# Altium schematic sheet Sheet1.SchDoc (part 3 of 3)
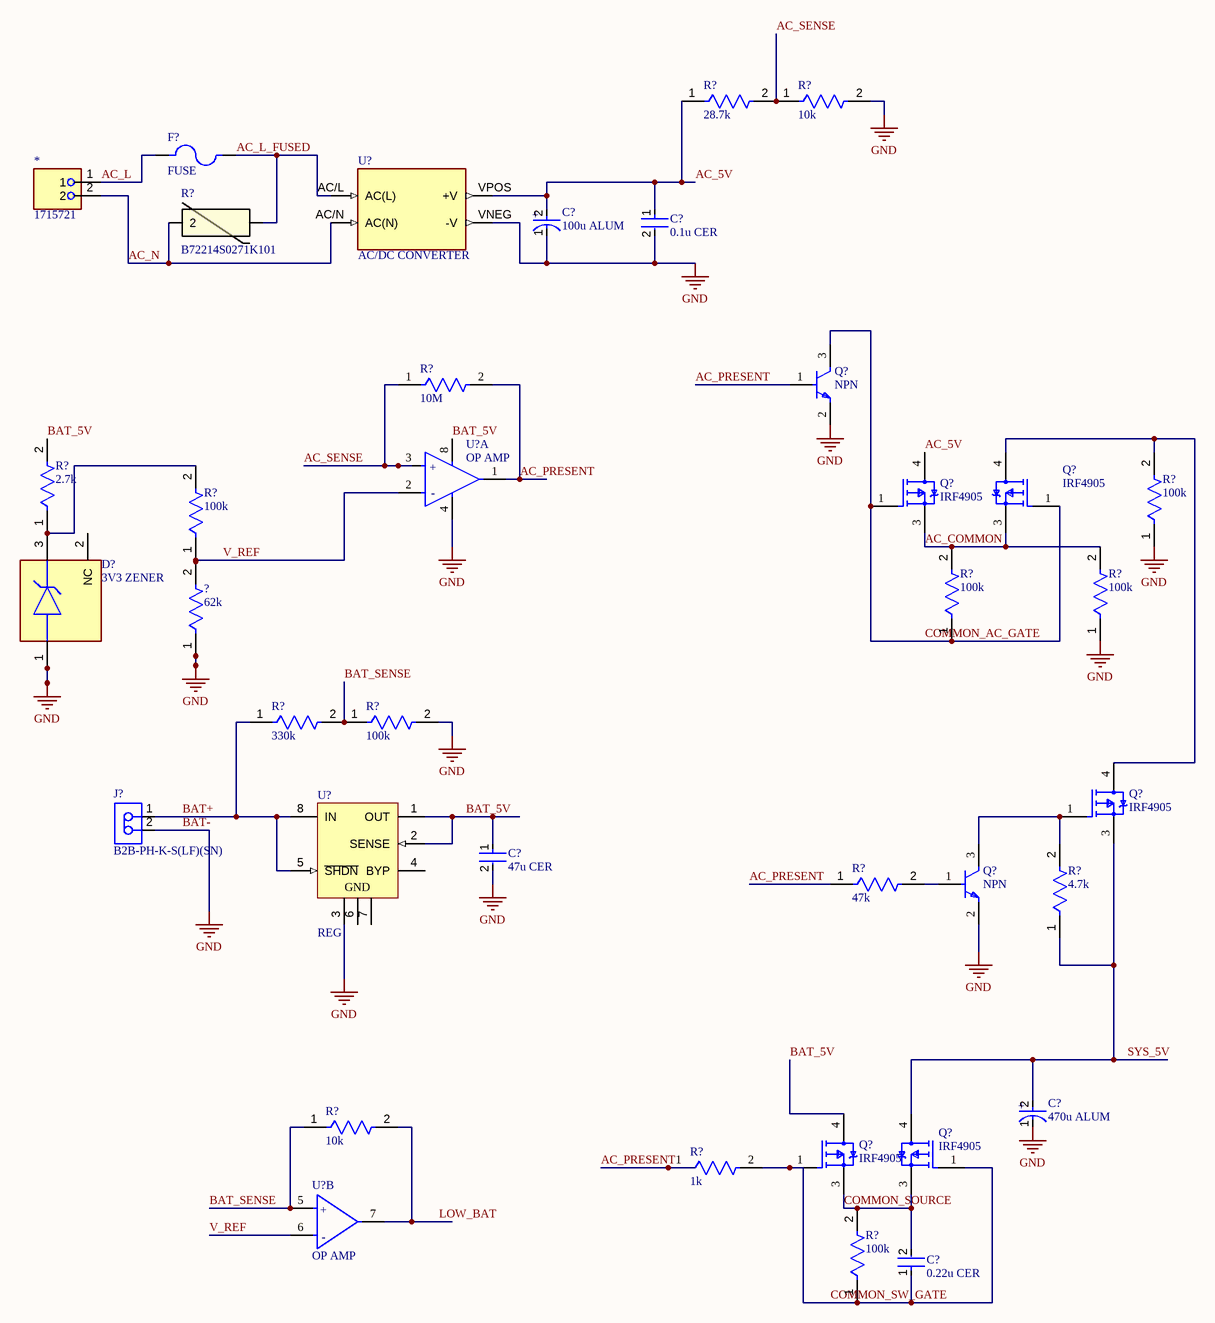
[diagram p2: Sheet1.SchDoc]

## Library data of the parts (continued)
R?#1 = RT0805BRD0728K7L: RES SMD 28.7K OHM 0.1% 1/8W 0805; Manufacturer: Yageo Group; Manufacturer Package Identifier: 0805 (2012 metric); Max Power Dissipation: 125mW; Value: 28.7kΩ; Temperature Coefficient: 25ppm/°C; Voltage Rating: 150V; Supplier: Avnet; Supplier Part Number: RT0805BRD0728K7L; Manufacturer Part Number: RT0805BRD0728K7L; RoHS: Compliant; Category: Chip SMD Resistors; Pricing: 5000=0.0408, 10000=0.0406, 20000=0.04039, 40000=0.04019, 80000=0.03998 (USD); Case/Package: 0805; Case Code (Imperial): 0805; China RoHS: Non-Compliant; Composition: Thin Film; Country of Origin: Mainland China, Taiwan; Depth: 1.25mm; Export Control Classification Number (ECCN) Code: EAR99; Height: 500µm; Harmonized Tariff Schedule (HTS) Code: 8533.21.00.30; Introduction Date: 2008-06-09; Lead Free: Lead Free; Length: 2mm; Lifecycle Status: Production; Max Operating Temperature: 155°C; Military Standard: Not; Min Operating Temperature: -55°C; Mounting Technology: Surface Mount; Number of Terminals: 2; Number of Terminations: 2; Power Rating: 125mW; REACH SVHC: Unaffected; Termination: SMD/SMT; Tolerance: 0.1%; Voltage Rating (DC): 150V; Weight: 5.499807mg; Width: 1.25mm; Working Voltage: 150V; ComponentLink1URL: https://datasheet.octopart.com:443/RT0805BRD0728K7L-Yageo-datasheet-176402239.pdf?src-supplier=IHS; ComponentLink1Description: https://datasheet.octopart.com:443/RT0805BRD0728K7L-Yageo-datasheet-176402239.pdf?src-supplier=IHS; ComponentLink2URL: https://datasheet.octopart.com:443/RT0805BRD0728K7L-Yageo-datasheet-96443642.pdf?src-supplier=Upverter; ComponentLink2Description: https://datasheet.octopart.com:443/RT0805BRD0728K7L-Yageo-datasheet-96443642.pdf?src-supplier=Upverter; ComponentLink3URL: https://datasheet.octopart.com:443/RT0805BRD0728K7L-Yageo-Group-datasheet-141265893.pdf?src-supplier=ODG+(Origin+Data+Global); ComponentLink3Description: https://datasheet.octopart.com:443/RT0805BRD0728K7L-Yageo-Group-datasheet-141265893.pdf?src-supplier=ODG+(Origin+Data+Global); ComponentLink4URL: https://datasheet.octopart.com/RT0805BRD0728K7L-Yageo-datasheet-86813807.pdf; ComponentLink4Description: https://datasheet.octopart.com/RT0805BRD0728K7L-Yageo-datasheet-86813807.pdf; ComponentLink5URL: http://sigma.octopart.com:80/conflict_mineral_statement/Yageo-company-3.pdf?src-supplier=Compliance+Statements; ComponentLink5Description: http://sigma.octopart.com:80/conflict_mineral_statement/Yageo-company-3.pdf?src-supplier=Compliance+Statements; ComponentLink6URL: http://sigma.octopart.com:80/rohs_statement/Yageo-company-2.pdf?src-supplier=Compliance+Statements; ComponentLink6Description: http://sigma.octopart.com:80/rohs_statement/Yageo-company-2.pdf?src-supplier=Compliance+Statements
R?#2 R?#14 = CRCW080510K0FKEA: RES SMD 10K OHM 1% 1/8W 0805; Manufacturer: Vishay; Manufacturer Package Identifier: CRCW0805-e3; Power Rating: 125mW; Value: 10kΩ; Temperature Coefficient: 100ppm/°C; Voltage Rating: 150V; Supplier: Future Electronics; Supplier Part Number: CRCW080510K0FKEA; Manufacturer Part Number: CRCW080510K0FKEA; RoHS: Compliant; Category: Chip SMD Resistors; Stock: 5460000; Pricing: 10000=0.0023, 50000=0.0022, 125000=0.0022, 375000=0.0021, 750000=0.002 (USD); Case/Package: 0805; Case Code (Imperial): 0805; China RoHS: Non-Compliant; Composition: Thick Film; Contact Plating: Tin; Country of Origin: Israel; Depth: 1.25mm; Export Control Classification Number (ECCN) Code: EAR99; Height: 450µm; Harmonized Tariff Schedule (HTS) Code: 8533.21.00.30; Introduction Date: 2005-02-16; Lead Free: Lead Free; Length: 2mm; Lifecycle Status: Production; Max Operating Temperature: 155°C; Military Standard: Not; Min Operating Temperature: -55°C; Mounting Technology: Surface Mount; Pins: 2; Number of Terminals: 2; Packaging: Cut Tape; Radiation Hardening: No; Ratings: AEC-Q200; REACH SVHC: Unaffected; Schedule B: 8533210045, 8533210045|8533210045|8533210045|8533210045|8533210045|8533210045|8533210045|8533210045|8533210045|8533210045|8533210045|8533210045|8533210045|8533210045|8533210045|8533210045|8533210045|8533210045|8533210045|8533210045|8533210045|8533210045|8533210045|85; Termination: SMD/SMT; Tolerance: 1%; Voltage Rating (DC): 150V; Weight: 5.499807mg; Width: 1.25mm; Working Voltage: 150V; ComponentLink1URL: https://datasheet.octopart.com:443/CRCW080510K0FKEA-Vishay-datasheet-175423584.pdf?src-supplier=IHS; ComponentLink1Description: https://datasheet.octopart.com:443/CRCW080510K0FKEA-Vishay-datasheet-175423584.pdf?src-supplier=IHS; ComponentLink2URL: https://datasheet.octopart.com:443/CRCW080510K0FKEA-Vishay-datasheet-5300368.pdf?src-supplier=Future+Electronics; ComponentLink2Description: https://datasheet.octopart.com:443/CRCW080510K0FKEA-Vishay-datasheet-5300368.pdf?src-supplier=Future+Electronics; ComponentLink3URL: https://datasheet.octopart.com:443/CRCW080510K0FKEA-Vishay-datasheet-62316122.pdf?src-supplier=Future+Electronics; ComponentLink3Description: https://datasheet.octopart.com:443/CRCW080510K0FKEA-Vishay-datasheet-62316122.pdf?src-supplier=Future+Electronics; ComponentLink4URL: https://datasheet.octopart.com:443/CRCW080510K0FKEA-Vishay-datasheet-83961561.pdf?src-supplier=Newark; ComponentLink4Description: https://datasheet.octopart.com:443/CRCW080510K0FKEA-Vishay-datasheet-83961561.pdf?src-supplier=Newark; ComponentLink5URL: https://datasheet.octopart.com:443/CRCW080510K0FKEA-Vishay-datasheet-14722531.pdf?src-supplier=Newark; ComponentLink5Description: https://datasheet.octopart.com:443/CRCW080510K0FKEA-Vishay-datasheet-14722531.pdf?src-supplier=Newark; ComponentLink6URL: https://datasheet.octopart.com:443/CRCW080510K0FKEA-Vishay-datasheet-62317937.pdf?src-supplier=Newark; ComponentLink6Description: https://datasheet.octopart.com:443/CRCW080510K0FKEA-Vishay-datasheet-62317937.pdf?src-supplier=Newark; ComponentLink7URL: https://datasheet.octopart.com:443/CRCW080510K0FKEA-Vishay-datasheet-11516975.pdf?src-supplier=Newark; ComponentLink7Description: https://datasheet.octopart.com:443/CRCW080510K0FKEA-Vishay-datasheet-11516975.pdf?src-supplier=Newark; ComponentLink8URL: https://datasheet.octopart.com:443/CRCW080510K0FKEA-Vishay-datasheet-183883877.pdf?src-supplier=Newark; ComponentLink8Description: https://datasheet.octopart.com:443/CRCW080510K0FKEA-Vishay-datasheet-183883877.pdf?src-supplier=Newark; ComponentLink9URL: https://datasheet.octopart.com:443/CRCW080510K0FKEA-Vishay-datasheet-41302739.pdf?src-supplier=Newark; ComponentLink9Description: https://datasheet.octopart.com:443/CRCW080510K0FKEA-Vishay-datasheet-41302739.pdf?src-supplier=Newark; ComponentLink10URL: https://datasheet.octopart.com:443/CRCW080510K0FKEA-Vishay-datasheet-27121962.pdf?src-supplier=Newark; ComponentLink10Description: https://datasheet.octopart.com:443/CRCW080510K0FKEA-Vishay-datasheet-27121962.pdf?src-supplier=Newark; ComponentLink11URL: https://datasheet.octopart.com:443/CRCW080510K0FKEA-Vishay-datasheet-16179825.pdf?src-supplier=element14+APAC; ComponentLink11Description: https://datasheet.octopart.com:443/CRCW080510K0FKEA-Vishay-datasheet-16179825.pdf?src-supplier=element14+APAC; ComponentLink12URL: https://datasheet.octopart.com:443/CRCW080510K0FKEA-Vishay-datasheet-66077789.pdf?src-supplier=element14+APAC; ComponentLink12Description: https://datasheet.octopart.com:443/CRCW080510K0FKEA-Vishay-datasheet-66077789.pdf?src-supplier=element14+APAC; ComponentLink13URL: https://datasheet.octopart.com:443/CRCW080510K0FKEA-Vishay-datasheet-5306405.pdf?src-supplier=RS+(Formerly+Allied+Electronics); ComponentLink13Description: https://datasheet.octopart.com:443/CRCW080510K0FKEA-Vishay-datasheet-5306405.pdf?src-supplier=RS+(Formerly+Allied+Electronics); ComponentLink14URL: https://datasheet.octopart.com:443/CRCW080510K0FKEA-Vishay-Dale-datasheet-47688880.pdf?src-supplier=RS+(Formerly+Allied+Electronics); ComponentLink14Description: https://datasheet.octopart.com:443/CRCW080510K0FKEA-Vishay-Dale-datasheet-47688880.pdf?src-supplier=RS+(Formerly+Allied+Electronics); ComponentLink15URL: https://datasheet.octopart.com:443/CRCW080510K0FKEA-Vishay-datasheet-12001583.pdf?src-supplier=RS+(Formerly+Allied+Electronics); ComponentLink15Description: https://datasheet.octopart.com:443/CRCW080510K0FKEA-Vishay-datasheet-12001583.pdf?src-supplier=RS+(Formerly+Allied+Electronics); ComponentLink16URL: https://datasheet.octopart.com:443/CRCW080510K0FKEA-Vishay-datasheet-17834126.pdf?src-supplier=TME; ComponentLink16Description: https://datasheet.octopart.com:443/CRCW080510K0FKEA-Vishay-datasheet-17834126.pdf?src-supplier=TME; ComponentLink17URL: https://datasheet.octopart.com/D-CRCW-e3-Standard-Thick-Film-Chip-Resistors-Vishay-datasheet-family-64.pdf; ComponentLink17Description: https://datasheet.octopart.com/D-CRCW-e3-Standard-Thick-Film-Chip-Resistors-Vishay-datasheet-family-64.pdf; ComponentLink18URL: https://datasheet.octopart.com:443/CRCW080510K0FKEA-Vishay-datasheet-13242068.pdf?src-supplier=Farnell; ComponentLink18Description: https://datasheet.octopart.com:443/CRCW080510K0FKEA-Vishay-datasheet-13242068.pdf?src-supplier=Farnell; ComponentLink19URL: https://datasheet.octopart.com:443/CRCW080510K0FKEA-Vishay-datasheet-13195083.pdf?src-supplier=Farnell; ComponentLink19Description: https://datasheet.octopart.com:443/CRCW080510K0FKEA-Vishay-datasheet-13195083.pdf?src-supplier=Farnell; ComponentLink20URL: https://datasheet.octopart.com:443/CRCW080510K0FKEA-Vishay-datasheet-13034211.pdf?src-supplier=Farnell; ComponentLink20Description: https://datasheet.octopart.com:443/CRCW080510K0FKEA-Vishay-datasheet-13034211.pdf?src-supplier=Farnell; ComponentLink21URL: https://datasheet.octopart.com:443/CRCW080510K0FKEA-Vishay-datasheet-12600034.pdf?src-supplier=Farnell; ComponentLink21Description: https://datasheet.octopart.com:443/CRCW080510K0FKEA-Vishay-datasheet-12600034.pdf?src-supplier=Farnell; ComponentLink22URL: https://datasheet.octopart.com:443/CRCW080510K0FKEA-Vishay-datasheet-12532161.pdf?src-supplier=Farnell; ComponentLink22Description: https://datasheet.octopart.com:443/CRCW080510K0FKEA-Vishay-datasheet-12532161.pdf?src-supplier=Farnell; ComponentLink23URL: https://datasheet.octopart.com:443/CRCW080510K0FKEA-Vishay-datasheet-12517896.pdf?src-supplier=Farnell; ComponentLink23Description: https://datasheet.octopart.com:443/CRCW080510K0FKEA-Vishay-datasheet-12517896.pdf?src-supplier=Farnell; ComponentLink24URL: https://datasheet.octopart.com:443/CRCW080510K0FKEA-Vishay-datasheet-12509762.pdf?src-supplier=Farnell; ComponentLink24Description: https://datasheet.octopart.com:443/CRCW080510K0FKEA-Vishay-datasheet-12509762.pdf?src-supplier=Farnell; ComponentLink25URL: https://datasheet.octopart.com:443/CRCW080510K0FKEA-Vishay-datasheet-10322335.pdf?src-supplier=Farnell; ComponentLink25Description: https://datasheet.octopart.com:443/CRCW080510K0FKEA-Vishay-datasheet-10322335.pdf?src-supplier=Farnell; ComponentLink26URL: https://datasheet.octopart.com:443/CRCW080510K0FKEA-Vishay-datasheet-8788789.pdf?src-supplier=Farnell; ComponentLink26Description: https://datasheet.octopart.com:443/CRCW080510K0FKEA-Vishay-datasheet-8788789.pdf?src-supplier=Farnell; ComponentLink27URL: https://datasheet.octopart.com:443/CRCW080510K0FKEA-Vishay-datasheet-8361388.pdf?src-supplier=Farnell; ComponentLink27Description: https://datasheet.octopart.com:443/CRCW080510K0FKEA-Vishay-datasheet-8361388.pdf?src-supplier=Farnell; ComponentLink28URL: https://datasheet.octopart.com:443/CRCW080510K0FKEA-Vishay-datasheet-546287.pdf?src-supplier=Farnell; ComponentLink28Description: https://datasheet.octopart.com:443/CRCW080510K0FKEA-Vishay-datasheet-546287.pdf?src-supplier=Farnell; ComponentLink29URL: https://datasheet.octopart.com:443/CRCW080510K0FKEA-Vishay-datasheet-11540273.pdf?src-supplier=Arrow+Electronics; ComponentLink29Description: https://datasheet.octopart.com:443/CRCW080510K0FKEA-Vishay-datasheet-11540273.pdf?src-supplier=Arrow+Electronics; ComponentLink30URL: https://datasheet.octopart.com:443/CRCW080510K0FKEA-Vishay-datasheet-8445837.pdf?src-supplier=element14; ComponentLink30Description: https://datasheet.octopart.com:443/CRCW080510K0FKEA-Vishay-datasheet-8445837.pdf?src-supplier=element14; ComponentLink31URL: https://datasheet.octopart.com:443/CRCW080510K0FKEA-Vishay-datasheet-5377306.pdf?src-supplier=Garrett; ComponentLink31Description: https://datasheet.octopart.com:443/CRCW080510K0FKEA-Vishay-datasheet-5377306.pdf?src-supplier=Garrett; ComponentLink32URL: https://datasheet.octopart.com:443/CRCW080510K0FKEA-Vishay-datasheet-148188.pdf?src-supplier=Garrett; ComponentLink32Description: https://datasheet.octopart.com:443/CRCW080510K0FKEA-Vishay-datasheet-148188.pdf?src-supplier=Garrett; ComponentLink33URL: https://datasheet.octopart.com:443/CRCW080510K0FKEA-Vishay-datasheet-34203.pdf?src-supplier=Garrett; ComponentLink33Description: https://datasheet.octopart.com:443/CRCW080510K0FKEA-Vishay-datasheet-34203.pdf?src-supplier=Garrett; ComponentLink34URL: http://sigma.octopart.com:80/rohs_certificate/D-CRCW-e3-Standard-Thick-Film-Chip-Resistors-Vishay-family-102.pdf?src-supplier=Compliance+Statements; ComponentLink34Description: http://sigma.octopart.com:80/rohs_certificate/D-CRCW-e3-Standard-Thick-Film-Chip-Resistors-Vishay-family-102.pdf?src-supplier=Compliance+Statements
R?#3 = B72214S0271K101: VARISTOR 430V 4.5KA DISC 14MM; Manufacturer_Name: TDK; Copyright: Copyright (C) 2026 Ultra Librarian. All rights reserved.; Manufacturer_Part_Number: B72214S0271K101
R?#4 = CRCW080510M0FKEA: RES SMD 10M OHM 1% 1/8W 0805; Manufacturer: Vishay; Manufacturer Package Identifier: CRCW0805-e3; Max Power Dissipation: 125mW; Value: 10MΩ; Temperature Coefficient: 100ppm/°C; Voltage Rating: 150V; Supplier: Future Electronics; Supplier Part Number: CRCW080510M0FKEA; Manufacturer Part Number: CRCW080510M0FKEA; RoHS: Compliant; Category: Chip SMD Resistors; Stock: 85000; Pricing: 5000=0.0094, 20000=0.0091, 50000=0.0089, 125000=0.0087, 200000=0.0084 (USD); Case/Package: 0805; Case Code (Imperial): 0805; China RoHS: Non-Compliant; Composition: Thick Film; Contact Plating: Tin; Country of Origin: Israel; Depth: 1.25mm; Export Control Classification Number (ECCN) Code: EAR99; Features: Automotive AEC-Q200; Height: 450µm; Harmonized Tariff Schedule (HTS) Code: 8533.21.00.30; Introduction Date: 2005-02-16; Lead Free: Lead Free; Length: 2mm; Lifecycle Status: Production; Max Operating Temperature: 155°C; Military Standard: Not; Min Operating Temperature: -55°C; Mounting Technology: Surface Mount; Pins: 2; Number of Terminals: 2; Number of Terminations: 2; Packaging: Cut Tape; Power Rating: 125mW; Radiation Hardening: No; Ratings: AEC-Q200; REACH SVHC: Unaffected; Schedule B: 8533210045, 8533210045|8533210045|8533210045|8533210045|8533210045|8533210045|8533210045|8533210045|8533210045|8533210045|8533210045|8533210045|8533210045|8533210045|8533210045|8533210045|8533210045|8533210045|8533210045|8533210045|8533210045|8533210045|8533210045|85; Termination: SMD/SMT; Tolerance: 1%; Voltage Rating (DC): 150V; Weight: 5.499807mg; Width: 1.25mm; Working Voltage: 150V; ComponentLink1URL: https://datasheet.octopart.com:443/CRCW080510M0FKEA-Vishay-datasheet-175423584.pdf?src-supplier=IHS; ComponentLink1Description: https://datasheet.octopart.com:443/CRCW080510M0FKEA-Vishay-datasheet-175423584.pdf?src-supplier=IHS; ComponentLink2URL: https://datasheet.octopart.com:443/CRCW080510M0FKEA-Vishay-datasheet-83961561.pdf?src-supplier=element14+APAC; ComponentLink2Description: https://datasheet.octopart.com:443/CRCW080510M0FKEA-Vishay-datasheet-83961561.pdf?src-supplier=element14+APAC; ComponentLink3URL: https://datasheet.octopart.com:443/CRCW080510M0FKEA-Vishay-datasheet-66077789.pdf?src-supplier=element14+APAC; ComponentLink3Description: https://datasheet.octopart.com:443/CRCW080510M0FKEA-Vishay-datasheet-66077789.pdf?src-supplier=element14+APAC; ComponentLink4URL: https://datasheet.octopart.com:443/CRCW080510M0FKEA-Vishay-datasheet-62317939.pdf?src-supplier=element14+APAC; ComponentLink4Description: https://datasheet.octopart.com:443/CRCW080510M0FKEA-Vishay-datasheet-62317939.pdf?src-supplier=element14+APAC; ComponentLink5URL: https://datasheet.octopart.com:443/CRCW080510M0FKEA-Vishay-datasheet-14722531.pdf?src-supplier=element14+APAC; ComponentLink5Description: https://datasheet.octopart.com:443/CRCW080510M0FKEA-Vishay-datasheet-14722531.pdf?src-supplier=element14+APAC; ComponentLink6URL: https://datasheet.octopart.com:443/CRCW080510M0FKEA-Vishay-datasheet-16179825.pdf?src-supplier=element14+APAC; ComponentLink6Description: https://datasheet.octopart.com:443/CRCW080510M0FKEA-Vishay-datasheet-16179825.pdf?src-supplier=element14+APAC; ComponentLink7URL: https://datasheet.octopart.com:443/CRCW080510M0FKEA.-Vishay-datasheet-78776211.pdf?src-supplier=Newark; ComponentLink7Description: https://datasheet.octopart.com:443/CRCW080510M0FKEA.-Vishay-datasheet-78776211.pdf?src-supplier=Newark; ComponentLink8URL: https://datasheet.octopart.com:443/CRCW080510M0FKEA-Vishay-datasheet-11516975.pdf?src-supplier=Newark; ComponentLink8Description: https://datasheet.octopart.com:443/CRCW080510M0FKEA-Vishay-datasheet-11516975.pdf?src-supplier=Newark; ComponentLink9URL: https://datasheet.octopart.com:443/CRCW080510M0FKEA-Vishay-datasheet-41302739.pdf?src-supplier=Newark; ComponentLink9Description: https://datasheet.octopart.com:443/CRCW080510M0FKEA-Vishay-datasheet-41302739.pdf?src-supplier=Newark; ComponentLink10URL: https://datasheet.octopart.com:443/CRCW080510M0FKEA-Vishay-datasheet-8.pdf?src-supplier=Newark; ComponentLink10Description: https://datasheet.octopart.com:443/CRCW080510M0FKEA-Vishay-datasheet-8.pdf?src-supplier=Newark; ComponentLink11URL: https://datasheet.octopart.com:443/CRCW080510M0FKEA-Vishay-datasheet-8725101.pdf?src-supplier=element14; ComponentLink11Description: https://datasheet.octopart.com:443/CRCW080510M0FKEA-Vishay-datasheet-8725101.pdf?src-supplier=element14; ComponentLink12URL: https://datasheet.octopart.com:443/CRCW080510M0FKEA-Vishay-datasheet-5306405.pdf?src-supplier=Future+Electronics; ComponentLink12Description: https://datasheet.octopart.com:443/CRCW080510M0FKEA-Vishay-datasheet-5306405.pdf?src-supplier=Future+Electronics; ComponentLink13URL: https://datasheet.octopart.com:443/CRCW080510M0FKEA-Vishay-datasheet-62316122.pdf?src-supplier=Future+Electronics; ComponentLink13Description: https://datasheet.octopart.com:443/CRCW080510M0FKEA-Vishay-datasheet-62316122.pdf?src-supplier=Future+Electronics; ComponentLink14URL: https://datasheet.octopart.com:443/CRCW080510M0FKEA-Vishay-datasheet-13242068.pdf?src-supplier=Future+Electronics; ComponentLink14Description: https://datasheet.octopart.com:443/CRCW080510M0FKEA-Vishay-datasheet-13242068.pdf?src-supplier=Future+Electronics; ComponentLink15URL: https://datasheet.octopart.com:443/CRCW080510M0FKEA-Vishay-datasheet-13195083.pdf?src-supplier=Future+Electronics; ComponentLink15Description: https://datasheet.octopart.com:443/CRCW080510M0FKEA-Vishay-datasheet-13195083.pdf?src-supplier=Future+Electronics; ComponentLink16URL: https://datasheet.octopart.com:443/CRCW080510M0FKEA-Vishay-datasheet-13034211.pdf?src-supplier=Future+Electronics; ComponentLink16Description: https://datasheet.octopart.com:443/CRCW080510M0FKEA-Vishay-datasheet-13034211.pdf?src-supplier=Future+Electronics; ComponentLink17URL: https://datasheet.octopart.com:443/CRCW080510M0FKEA-Vishay-datasheet-12600034.pdf?src-supplier=Future+Electronics; ComponentLink17Description: https://datasheet.octopart.com:443/CRCW080510M0FKEA-Vishay-datasheet-12600034.pdf?src-supplier=Future+Electronics; ComponentLink18URL: https://datasheet.octopart.com:443/CRCW080510M0FKEA-Vishay-datasheet-12532161.pdf?src-supplier=Future+Electronics; ComponentLink18Description: https://datasheet.octopart.com:443/CRCW080510M0FKEA-Vishay-datasheet-12532161.pdf?src-supplier=Future+Electronics; ComponentLink19URL: https://datasheet.octopart.com:443/CRCW080510M0FKEA-Vishay-datasheet-12517896.pdf?src-supplier=Future+Electronics; ComponentLink19Description: https://datasheet.octopart.com:443/CRCW080510M0FKEA-Vishay-datasheet-12517896.pdf?src-supplier=Future+Electronics; ComponentLink20URL: https://datasheet.octopart.com:443/CRCW080510M0FKEA-Vishay-datasheet-12509762.pdf?src-supplier=Future+Electronics; ComponentLink20Description: https://datasheet.octopart.com:443/CRCW080510M0FKEA-Vishay-datasheet-12509762.pdf?src-supplier=Future+Electronics; ComponentLink21URL: https://datasheet.octopart.com:443/CRCW080510M0FKEA-Vishay-datasheet-10322335.pdf?src-supplier=Future+Electronics; ComponentLink21Description: https://datasheet.octopart.com:443/CRCW080510M0FKEA-Vishay-datasheet-10322335.pdf?src-supplier=Future+Electronics; ComponentLink22URL: https://datasheet.octopart.com:443/CRCW080510M0FKEA-Vishay-datasheet-8788789.pdf?src-supplier=Future+Electronics; ComponentLink22Description: https://datasheet.octopart.com:443/CRCW080510M0FKEA-Vishay-datasheet-8788789.pdf?src-supplier=Future+Electronics; ComponentLink23URL: https://datasheet.octopart.com:443/CRCW080510M0FKEA-Vishay-datasheet-8361388.pdf?src-supplier=Future+Electronics; ComponentLink23Description: https://datasheet.octopart.com:443/CRCW080510M0FKEA-Vishay-datasheet-8361388.pdf?src-supplier=Future+Electronics; ComponentLink24URL: https://datasheet.octopart.com:443/CRCW080510M0FKEA-Vishay-datasheet-546287.pdf?src-supplier=Future+Electronics; ComponentLink24Description: https://datasheet.octopart.com:443/CRCW080510M0FKEA-Vishay-datasheet-546287.pdf?src-supplier=Future+Electronics; ComponentLink25URL: https://datasheet.octopart.com:443/CRCW080510M0FKEA-Vishay-datasheet-137114595.pdf?src-supplier=X-ON; ComponentLink25Description: https://datasheet.octopart.com:443/CRCW080510M0FKEA-Vishay-datasheet-137114595.pdf?src-supplier=X-ON; ComponentLink26URL: https://datasheet.octopart.com:443/CRCW080510M0FKEA-Vishay-Dale-datasheet-47688880.pdf?src-supplier=RS+(Formerly+Allied+Electronics); ComponentLink26Description: https://datasheet.octopart.com:443/CRCW080510M0FKEA-Vishay-Dale-datasheet-47688880.pdf?src-supplier=RS+(Formerly+Allied+Electronics); ComponentLink27URL: https://datasheet.octopart.com:443/CRCW080510M0FKEA-Vishay-datasheet-12001583.pdf?src-supplier=RS+(Formerly+Allied+Electronics); ComponentLink27Description: https://datasheet.octopart.com:443/CRCW080510M0FKEA-Vishay-datasheet-12001583.pdf?src-supplier=RS+(Formerly+Allied+Electronics); ComponentLink28URL: https://datasheet.octopart.com/D-CRCW-e3-Standard-Thick-Film-Chip-Resistors-Vishay-datasheet-family-64.pdf; ComponentLink28Description: https://datasheet.octopart.com/D-CRCW-e3-Standard-Thick-Film-Chip-Resistors-Vishay-datasheet-family-64.pdf; ComponentLink29URL: https://datasheet.octopart.com:443/CRCW080510M0FKEA-Vishay-datasheet-5377306.pdf?src-supplier=Garrett; ComponentLink29Description: https://datasheet.octopart.com:443/CRCW080510M0FKEA-Vishay-datasheet-5377306.pdf?src-supplier=Garrett; ComponentLink30URL: http://sigma.octopart.com:80/rohs_certificate/D-CRCW-e3-Standard-Thick-Film-Chip-Resistors-Vishay-family-102.pdf?src-supplier=Compliance+Statements; ComponentLink30Description: http://sigma.octopart.com:80/rohs_certificate/D-CRCW-e3-Standard-Thick-Film-Chip-Resistors-Vishay-family-102.pdf?src-supplier=Compliance+Statements
R?#5 = CRCW08052K70FKEA: RES SMD 2.7K OHM 1% 1/8W 0805; Voltage Rating (DC): 150V; Power Rating: 125mW; Resistance: 2.7kR; Temperature Coefficient: 100ppm/°C; Composition: Thick Film; Mount: Surface Mount; Case Code (Imperial): 0805; Features: Automotive AEC-Q200; Depth: 1.25mm; Height: 0.45mm; Weight: 0.000194oz; Min Operating Temperature: -55°C; Case Code (Metric): 2012; Number of Pins: 2; Packaging: Tape and Reel; Width: 1.25mm; Military Standard: Not; Max Power Dissipation: 125mW; Tolerance: 1%; Case/Package: 0805; Lead Free: Lead Free; Max Operating Temperature: 155°C; Number of Terminations: 2; Voltage Rating: 150V; Contact Plating: Tin; Length: 2mm; Termination: SMD/SMT; Package Quantity: 10; Radiation Hardening: No
R?#6-R?#9 R?#11 R?#16 = CRCW0805100KFKEA: RES SMD 100K OHM 1% 1/8W 0805; Resistance: 100kR; Power Rating: 125mW; Voltage Rating: 150V; Temperature Coefficient: 100ppm/°C; Case/Package: 0805; Max Operating Temperature: 155°C; Case Code (Imperial): 0805; Lead Free: Lead Free; Weight: 0.000194oz; Number of Pins: 2; Package Quantity: 5000; Height: 0.45mm; Composition: Thick Film; Military Standard: Not; Tolerance: 1%; Case Code (Metric): 2012; Termination: SMD/SMT; Mount: Surface Mount; Radiation Hardening: No; Width: 1.25mm; Length: 2mm; Depth: 1.25mm; Packaging: Tape and Reel; Min Operating Temperature: -55°C; Contact Plating: Tin; Voltage Rating (DC): 150V
R?#10 = RC0805FR-07330KL: RES SMD 330K OHM 1% 1/8W 0805; Manufacturer: Yageo Group; Max Power Dissipation: 125mW; Value: 330kΩ; Temperature Coefficient: 100ppm/°C; Voltage Rating: 150V; Supplier: Future Electronics; Supplier Part Number: RC0805FR-07330KL; Manufacturer Part Number: RC0805FR-07330KL; RoHS: Compliant; Category: Chip SMD Resistors; Stock: 330000; Pricing: 5000=0.0068, 20000=0.0065, 75000=0.0063, 150000=0.0062, 375000=0.006 (USD); Case/Package: 0805; Case Code (Imperial): 0805; China RoHS: Non-Compliant; Composition: Thick Film; Contact Plating: Tin; Country of Origin: Mainland China, Taiwan; Depth: 1.25mm; Export Control Classification Number (ECCN) Code: EAR99; Features: Moisture Resistant; Height: 500µm; Harmonized Tariff Schedule (HTS) Code: 8533.21.00.30; Introduction Date: 2004-09-22; Lead Free: Lead Free; Length: 2mm; Lifecycle Status: Production; Max Operating Temperature: 155°C; Military Standard: Not; Min Operating Temperature: -55°C; Mounting Technology: Surface Mount; Pins: 2; Number of Terminals: 2; Number of Terminations: 2; Packaging: Tape & Reel; Power Rating: 125mW; Radiation Hardening: No; REACH SVHC: Unaffected; Schedule B: 8533210045, 8533210045|8533210045|8533210045|8533210045|8533210045; Termination: SMD/SMT; Tolerance: 1%; Voltage Rating (AC): 150V; Voltage Rating (DC): 150V; Width: 1.25mm; Working Voltage: 150V; ComponentLink1URL: https://datasheet.octopart.com:443/RC0805FR-07330KL-Yageo-datasheet-175887523.pdf?src-supplier=IHS; ComponentLink1Description: https://datasheet.octopart.com:443/RC0805FR-07330KL-Yageo-datasheet-175887523.pdf?src-supplier=IHS; ComponentLink2URL: https://datasheet.octopart.com:443/RC0805FR-07330KL-Yageo-datasheet-103092701.pdf?src-supplier=Upverter; ComponentLink2Description: https://datasheet.octopart.com:443/RC0805FR-07330KL-Yageo-datasheet-103092701.pdf?src-supplier=Upverter; ComponentLink3URL: https://datasheet.octopart.com:443/RC0805FR-07330KL-Yageo-datasheet-8330313.pdf?src-supplier=element14+APAC; ComponentLink3Description: https://datasheet.octopart.com:443/RC0805FR-07330KL-Yageo-datasheet-8330313.pdf?src-supplier=element14+APAC; ComponentLink4URL: https://datasheet.octopart.com:443/RC0805FR-07330KL-Yageo-Group-datasheet-190305687.pdf?src-supplier=Future+Electronics; ComponentLink4Description: https://datasheet.octopart.com:443/RC0805FR-07330KL-Yageo-Group-datasheet-190305687.pdf?src-supplier=Future+Electronics; ComponentLink5URL: https://datasheet.octopart.com:443/RC0805FR-07330KL-Yageo-datasheet-164759695.pdf?src-supplier=Future+Electronics; ComponentLink5Description: https://datasheet.octopart.com:443/RC0805FR-07330KL-Yageo-datasheet-164759695.pdf?src-supplier=Future+Electronics; ComponentLink6URL: https://datasheet.octopart.com:443/RC0805FR-07330KL-Yageo-datasheet-127823281.pdf?src-supplier=Future+Electronics; ComponentLink6Description: https://datasheet.octopart.com:443/RC0805FR-07330KL-Yageo-datasheet-127823281.pdf?src-supplier=Future+Electronics; ComponentLink7URL: https://datasheet.octopart.com:443/RC0805FR-07330KL-Yageo-datasheet-137700087.pdf?src-supplier=Future+Electronics; ComponentLink7Description: https://datasheet.octopart.com:443/RC0805FR-07330KL-Yageo-datasheet-137700087.pdf?src-supplier=Future+Electronics; ComponentLink8URL: https://datasheet.octopart.com:443/RC0805FR-07330KL-Yageo-datasheet-12592811.pdf?src-supplier=Future+Electronics; ComponentLink8Description: https://datasheet.octopart.com:443/RC0805FR-07330KL-Yageo-datasheet-12592811.pdf?src-supplier=Future+Electronics; ComponentLink9URL: https://datasheet.octopart.com:443/RC0805FR-07330KL-Yageo-datasheet-8324252.pdf?src-supplier=Future+Electronics; ComponentLink9Description: https://datasheet.octopart.com:443/RC0805FR-07330KL-Yageo-datasheet-8324252.pdf?src-supplier=Future+Electronics; ComponentLink10URL: https://datasheet.octopart.com:443/RC0805FR-07330KL-Yageo-datasheet-62067350.pdf?src-supplier=Farnell; ComponentLink10Description: https://datasheet.octopart.com:443/RC0805FR-07330KL-Yageo-datasheet-62067350.pdf?src-supplier=Farnell; ComponentLink11URL: https://datasheet.octopart.com:443/RC0805FR-07330KL-Yageo-datasheet-13691069.pdf?src-supplier=Farnell; ComponentLink11Description: https://datasheet.octopart.com:443/RC0805FR-07330KL-Yageo-datasheet-13691069.pdf?src-supplier=Farnell; ComponentLink12URL: https://datasheet.octopart.com:443/RC0805FR-07330KL-Yageo-Group-datasheet-189192902.pdf?src-supplier=LCSC; ComponentLink12Description: https://datasheet.octopart.com:443/RC0805FR-07330KL-Yageo-Group-datasheet-189192902.pdf?src-supplier=LCSC; ComponentLink13URL: https://datasheet.octopart.com/RC0805FR-07330KL-Yageo-datasheet-73766026.pdf; ComponentLink13Description: https://datasheet.octopart.com/RC0805FR-07330KL-Yageo-datasheet-73766026.pdf; ComponentLink14URL: https://datasheet.octopart.com:443/RC0805FR-07330KL-Yageo-datasheet-118657.pdf?src-supplier=DigiKey; ComponentLink14Description: https://datasheet.octopart.com:443/RC0805FR-07330KL-Yageo-datasheet-118657.pdf?src-supplier=DigiKey; ComponentLink15URL: http://sigma.octopart.com:80/conflict_mineral_statement/Yageo-company-3.pdf?src-supplier=Compliance+Statements; ComponentLink15Description: http://sigma.octopart.com:80/conflict_mineral_statement/Yageo-company-3.pdf?src-supplier=Compliance+Statements; ComponentLink16URL: http://sigma.octopart.com:80/rohs_statement/Yageo-company-2.pdf?src-supplier=Compliance+Statements; ComponentLink16Description: http://sigma.octopart.com:80/rohs_statement/Yageo-company-2.pdf?src-supplier=Compliance+Statements
R?#12 = RC0805FR-0747KL: RES SMD 47K OHM 1% 1/8W 0805; Manufacturer: Yageo; Voltage Rating: 150 V; Height: 0.5 mm; ComponentLink2URL: http://www.yageo.com/documents/recent/PYu-RC_Group_51_RoHS_L_04.pdf; ComponentLink2Description: Datasheet; Package Quantity: 200; Max Operating Temperature: 155 degC; Min Operating Temperature: -55 degC; Packaging: Tape and Reel; Pins: 2; PackageReference: 0805; Mounting Technology: Surface Mount; ComponentLink1Description: Manufacturer URL; ComponentLink1URL: http://www.yageo.com/; PackageDescription: 2-Pin Surface Mounted Device, Body 2 x 1.25 mm; Length: 2 mm; REACH SVHC: No SVHC; Mount: Surface Mount; RoHSCompliant: true; DatasheetVersion: Rev. 4, 02/2016
R?#13 = CRCW08054K70FKEA: RES SMD 4.7K OHM 1% 1/8W 0805; Max Power Dissipation: 125mW; Resistance: 4.7kR; Voltage Rating: 150V; Temperature Coefficient: 100ppm/°C; Termination: SMD/SMT; Weight: 0.000194oz; Case/Package: 0805; Number of Terminations: 2; Min Operating Temperature: -55°C; Case Code (Metric): 2012; Package Quantity: 10; Depth: 1.25mm; Military Standard: Not; Composition: Thick Film; Radiation Hardening: No; Contact Plating: Tin; Height: 0.45mm; Power Rating: 125mW; Features: Automotive AEC-Q200; Tolerance: 1%; Packaging: Tape and Reel; Max Operating Temperature: 155°C; Length: 2mm; Case Code (Imperial): 0805; Voltage Rating (DC): 150V; Width: 1.25mm; Lead Free: Lead Free
R?#15 = CRCW08051K00FKEA: RES SMD 1K OHM 1% 1/8W 0805; Manufacturer: Vishay Dale; Part Number: CRCW08051K00FKEA
U?#1 = IRM-05-5: AC/DC CONVERTER 5V 5W; Manufacturer: Mean Well; Approvals: CB, CE, IEC, TUV, UL; Current - Output 1: 1A; Efficiency: 71%; Max Supply Voltage: 305V; Max Output Voltage: 5.125V; Min Input Voltage: 85V; Min Output Voltage: 4.875V; Nominal Supply Voltage: 115V; Number of Circuits: 1; Supplier: Arrow Electronics; Supplier Part Number: IRM-05-5; Manufacturer Part Number: IRM-05-5; RoHS: Compliant; Category: Power Supply Modules; Stock: 18160; Pricing: 1=7.467, 20=7.35, 50=7.162 (USD); Composition: Hybrid; Export Control Classification Number (ECCN) Code: EAR99; Height: 21.5mm; Height - Seated (Max): 21.5mm; Introduction Date: 2013-07-05; Lead Free: Lead Free; Length: 45.7mm; Lifecycle Status: Production; Max Operating Temperature: 70°C; Max Output current: 1A; Max Output Power: 5W; Max Power Dissipation: 5W; Min Operating Temperature: -30°C; Min Supply Voltage: 85V; Mounting Technology: PCB, Through Hole; Nominal Output Voltage: 5V; Number of Outputs: 1; Pins: 4; Number of Terminals: 4; Output Current: 1A; Output Power: 5W; Output Voltage: 5V; REACH SVHC: Unaffected; Voltage - Output 1: 5V; Weight: 39.999986g; Width: 25.4mm; ComponentLink1URL: https://datasheet.octopart.com:443/IRM-05-5-Mean-Well-datasheet-180626755.pdf?src-supplier=IHS; ComponentLink1Description: https://datasheet.octopart.com:443/IRM-05-5-Mean-Well-datasheet-180626755.pdf?src-supplier=IHS; ComponentLink2URL: https://datasheet.octopart.com:443/IRM-05-5-Mean-Well-datasheet-101610177.pdf?src-supplier=Farnell; ComponentLink2Description: https://datasheet.octopart.com:443/IRM-05-5-Mean-Well-datasheet-101610177.pdf?src-supplier=Farnell; ComponentLink3URL: https://datasheet.octopart.com:443/IRM-05-5-Mean-Well-datasheet-67333141.pdf?src-supplier=Sager+Power+Systems; ComponentLink3Description: https://datasheet.octopart.com:443/IRM-05-5-Mean-Well-datasheet-67333141.pdf?src-supplier=Sager+Power+Systems; ComponentLink4URL: https://datasheet.octopart.com:443/IRM-05-5-Mean-Well-datasheet-154740696.pdf?src-supplier=Master+Electronics; ComponentLink4Description: https://datasheet.octopart.com:443/IRM-05-5-Mean-Well-datasheet-154740696.pdf?src-supplier=Master+Electronics; ComponentLink5URL: https://datasheet.octopart.com:443/IRM-05-5-Mean-Well-datasheet-34148673.pdf?src-supplier=Future+Electronics; ComponentLink5Description: https://datasheet.octopart.com:443/IRM-05-5-Mean-Well-datasheet-34148673.pdf?src-supplier=Future+Electronics; ComponentLink6URL: https://datasheet.octopart.com:443/IRM-05-5-Mean-Well-datasheet-27625340.pdf?src-supplier=Jameco+(USA); ComponentLink6Description: https://datasheet.octopart.com:443/IRM-05-5-Mean-Well-datasheet-27625340.pdf?src-supplier=Jameco+(USA); ComponentLink7URL: https://datasheet.octopart.com:443/IRM-05-5-Mean-Well-datasheet-19208722.pdf?src-supplier=Telerex+Europe; ComponentLink7Description: https://datasheet.octopart.com:443/IRM-05-5-Mean-Well-datasheet-19208722.pdf?src-supplier=Telerex+Europe; ComponentLink8URL: https://datasheet.octopart.com:443/IRM-05-5-Mean-Well-datasheet-194193599.pdf?src-supplier=LCSC; ComponentLink8Description: https://datasheet.octopart.com:443/IRM-05-5-Mean-Well-datasheet-194193599.pdf?src-supplier=LCSC; ComponentLink9URL: https://datasheet.octopart.com:443/IRM-05-5-Mean-Well-datasheet-158921293.pdf?src-supplier=Component+Distributors+Inc.; ComponentLink9Description: https://datasheet.octopart.com:443/IRM-05-5-Mean-Well-datasheet-158921293.pdf?src-supplier=Component+Distributors+Inc.; ComponentLink10URL: https://datasheet.octopart.com:443/IRM-05-5-Mean-Well-datasheet-137204475.pdf?src-supplier=Component+Distributors+Inc.; ComponentLink10Description: https://datasheet.octopart.com:443/IRM-05-5-Mean-Well-datasheet-137204475.pdf?src-supplier=Component+Distributors+Inc.; ComponentLink11URL: https://datasheet.octopart.com:443/IRM-05-5-Mean-Well-datasheet-151511263.pdf?src-supplier=TME; ComponentLink11Description: https://datasheet.octopart.com:443/IRM-05-5-Mean-Well-datasheet-151511263.pdf?src-supplier=TME; ComponentLink12URL: https://datasheet.octopart.com:443/IRM-05-5-Mean-Well-datasheet-151511270.pdf?src-supplier=TME; ComponentLink12Description: https://datasheet.octopart.com:443/IRM-05-5-Mean-Well-datasheet-151511270.pdf?src-supplier=TME; ComponentLink13URL: https://datasheet.octopart.com:443/IRM-05-5-Mean-Well-datasheet-83579035.pdf?src-supplier=TME; ComponentLink13Description: https://datasheet.octopart.com:443/IRM-05-5-Mean-Well-datasheet-83579035.pdf?src-supplier=TME; ComponentLink14URL: https://datasheet.octopart.com:443/IRM-05-5-Mean-Well-datasheet-24998212.pdf?src-supplier=TME; ComponentLink14Description: https://datasheet.octopart.com:443/IRM-05-5-Mean-Well-datasheet-24998212.pdf?src-supplier=TME; ComponentLink15URL: https://datasheet.octopart.com:443/IRM-05-5-Mean-Well-datasheet-140567947.pdf?src-supplier=Arrow.cn; ComponentLink15Description: https://datasheet.octopart.com:443/IRM-05-5-Mean-Well-datasheet-140567947.pdf?src-supplier=Arrow.cn
U?#2 U?#4 = TLV9062IDR: IC OP AMP 2CH 8-SOIC; Slew Rate: 6.5V/µs; Number of Channels: 2; Input Offset Voltage (Vos): 300uV; Input Bias Current: 0.5pA; Output Current per Channel: 50mA; Gain Bandwidth Product: 10MHz; Operating Supply Current: 538uA; RoHS Compliant: Yes; Case/Package: SOIC; Number of Circuits: 2; Number of Pins: 8; Mount: Surface Mount; Max Operating Temperature: 125°C; Min Operating Temperature: -40°C; Packaging: Tape and Reel
U?#3 = LT1763IS8-5#PBF: IC REG LINEAR 5V 500MA 8-SO; Manufacturer: Analog Devices; Manufacturer Lifecycle Status: PRODUCTION; Dropout Voltage: 300mV; Max Supply Voltage: 20V; Min Current Limit: 520mA; Min Input Voltage: 1.8V; Number of Outputs: 1; Operating Supply Current: 30µA; Output Type: Fixed; Polarity: Positive; Power Supply Rejection Ratio (PSRR): 65dB; Supplier: Arrow Electronics; Supplier Part Number: LT1763IS8-5#PBF; Manufacturer Part Number: LT1763IS8-5#PBF; RoHS: Compliant; Category: LDO Voltage Regulators; Stock: 119; Pricing: 1=7.815, 10=5.751, 25=5.694, 100=5.072 (USD); Lifecycle Status: Production; Max Operating Temperature: 125°C; Min Operating Temperature: -40°C; Nominal Output Voltage: 5V; Pins: 8; Number of Regulators: 1; Output Current: 500mA; Output Voltage: 5V; REACH SVHC: Unaffected; Schedule B: 8542390000, 8542390000|8542390000|8542390000|8542390000|8542390000|8542390000|8542390000|8542390000|8542390000|8542390000|8542390000|8542390000|8542390000|8542390000|8542390000|8542390000|8542390000|8542390000|8542390000|8542390000|8542390000|8542390000|8542390000|85; ComponentLink1URL: https://octopart.com:443/opatz8j6/c1?t=Ebpcw7CmPQtKNRnGwzCsB8Km5QI9SJKjuQjJH0aKtBETBPytFrpjDY6oFgIq1hiQXU_Ry5HVNKnDBr9_yr5U1VD3FTwTD8YC5rP2o44Ab-hGVQM7czKy67lcZ3cEKdPmXMg_Z_cGbSh3vKzdLA1h_IU9v3WoVfL7cJSuIKmWmZ6Fprabk8AzFbd_zlTnU_mZmTTWMhcBBAtpUXbuQYrFbJG3wspjmbLLERIatjPVcqSkkM_MuCcFPHZJZUl04vK-K-3Q5sidJHL7KRZw34vc0DdA8yiHVpnaAIuodgrAzMkxjVJPvC5okA&src-supplier=Analog+Devices; ComponentLink1Description: https://octopart.com:443/opatz8j6/c1?t=Ebpcw7CmPQtKNRnGwzCsB8Km5QI9SJKjuQjJH0aKtBETBPytFrpjDY6oFgIq1hiQXU_Ry5HVNKnDBr9_yr5U1VD3FTwTD8YC5rP2o44Ab-hGVQM7czKy67lcZ3cEKdPmXMg_Z_cGbSh3vKzdLA1h_IU9v3WoVfL7cJSuIKmWmZ6Fprabk8AzFbd_zlTnU_mZmTTWMhcBBAtpUXbuQYrFbJG3wspjmbLLERIatjPVcqSkkM_MuCcFPHZJZUl04vK-K-3Q5sidJHL7KRZw34vc0DdA8yiHVpnaAIuodgrAzMkxjVJPvC5okA&src-supplier=Analog+Devices; ComponentLink2URL: https://datasheet.octopart.com:443/LT1763IS8-5%23PBF-Linear-Technology-datasheet-10687378.pdf?src-supplier=Upverter; ComponentLink2Description: https://datasheet.octopart.com:443/LT1763IS8-5%23PBF-Linear-Technology-datasheet-10687378.pdf?src-supplier=Upverter; ComponentLink3URL: https://datasheet.octopart.com:443/LT1763IS8-5%23PBF-Analog-Devices-datasheet-34225385.pdf?src-supplier=element14+APAC; ComponentLink3Description: https://datasheet.octopart.com:443/LT1763IS8-5%23PBF-Analog-Devices-datasheet-34225385.pdf?src-supplier=element14+APAC; ComponentLink4URL: https://datasheet.octopart.com:443/LT1763IS8-5%23PBF-Linear-Technology-datasheet-8700792.pdf?src-supplier=Farnell; ComponentLink4Description: https://datasheet.octopart.com:443/LT1763IS8-5%23PBF-Linear-Technology-datasheet-8700792.pdf?src-supplier=Farnell; ComponentLink5URL: https://sigma.octopart.com:443/57689574/technical_drawing/Linear-Technology-LT1763IS8-5%23PBF.pdf?src-supplier=Linear+Technology; ComponentLink5Description: https://sigma.octopart.com:443/57689574/technical_drawing/Linear-Technology-LT1763IS8-5%23PBF.pdf?src-supplier=Linear+Technology; ComponentLink6URL: https://datasheet.octopart.com:443/LT1763IS8-5%23PBF-Linear-Technology-datasheet-503827.pdf?src-supplier=Component+Distributors+Inc.; ComponentLink6Description: https://datasheet.octopart.com:443/LT1763IS8-5%23PBF-Linear-Technology-datasheet-503827.pdf?src-supplier=Component+Distributors+Inc.; ComponentLink7URL: http://sigma.octopart.com:80/conflict_mineral_statement/Analog-Devices-company-33.pdf?src-supplier=Compliance+Statements; ComponentLink7Description: http://sigma.octopart.com:80/conflict_mineral_statement/Analog-Devices-company-33.pdf?src-supplier=Compliance+Statements; ComponentLink8URL: https://octopart.com:443/opatz8j6/c1?t=kVQKxYRg13CYfxrdy69KyFd_rl0hY_LDqWrQ1YyOKtTyuOMylFgcnP0bVUf3GNrw39o-SRsGyQXIdnmWtO9oyzBU0EuAiBa8NCdTUj49_csqsGjvb8cZ9nRchLctyLtWi99s3K5VC9WM2qNU-bZvQtidgMGLK4xXjXMUZ0FmF3SNi_KWH-PQucqQoFGvz1WqkLsK056S5i-IR1Z8uIKtKSojWwisOZKXV74ikTz1ClZZY-pb3NQiLtvP1d0Ba0e-hiuaWQXP8NV9QpynSvhLpLEizviPxLHwFDE0Ky8Efs26IPoaZupI1Q&src-supplier=Compliance+Statements; ComponentLink8Description: https://octopart.com:443/opatz8j6/c1?t=kVQKxYRg13CYfxrdy69KyFd_rl0hY_LDqWrQ1YyOKtTyuOMylFgcnP0bVUf3GNrw39o-SRsGyQXIdnmWtO9oyzBU0EuAiBa8NCdTUj49_csqsGjvb8cZ9nRchLctyLtWi99s3K5VC9WM2qNU-bZvQtidgMGLK4xXjXMUZ0FmF3SNi_KWH-PQucqQoFGvz1WqkLsK056S5i-IR1Z8uIKtKSojWwisOZKXV74ikTz1ClZZY-pb3NQiLtvP1d0Ba0e-hiuaWQXP8NV9QpynSvhLpLEizviPxLHwFDE0Ky8Efs26IPoaZupI1Q&src-supplier=Compliance+Statements